# EAGLE design stm32103c8t6-v5 (EAGLE 7.4.0)
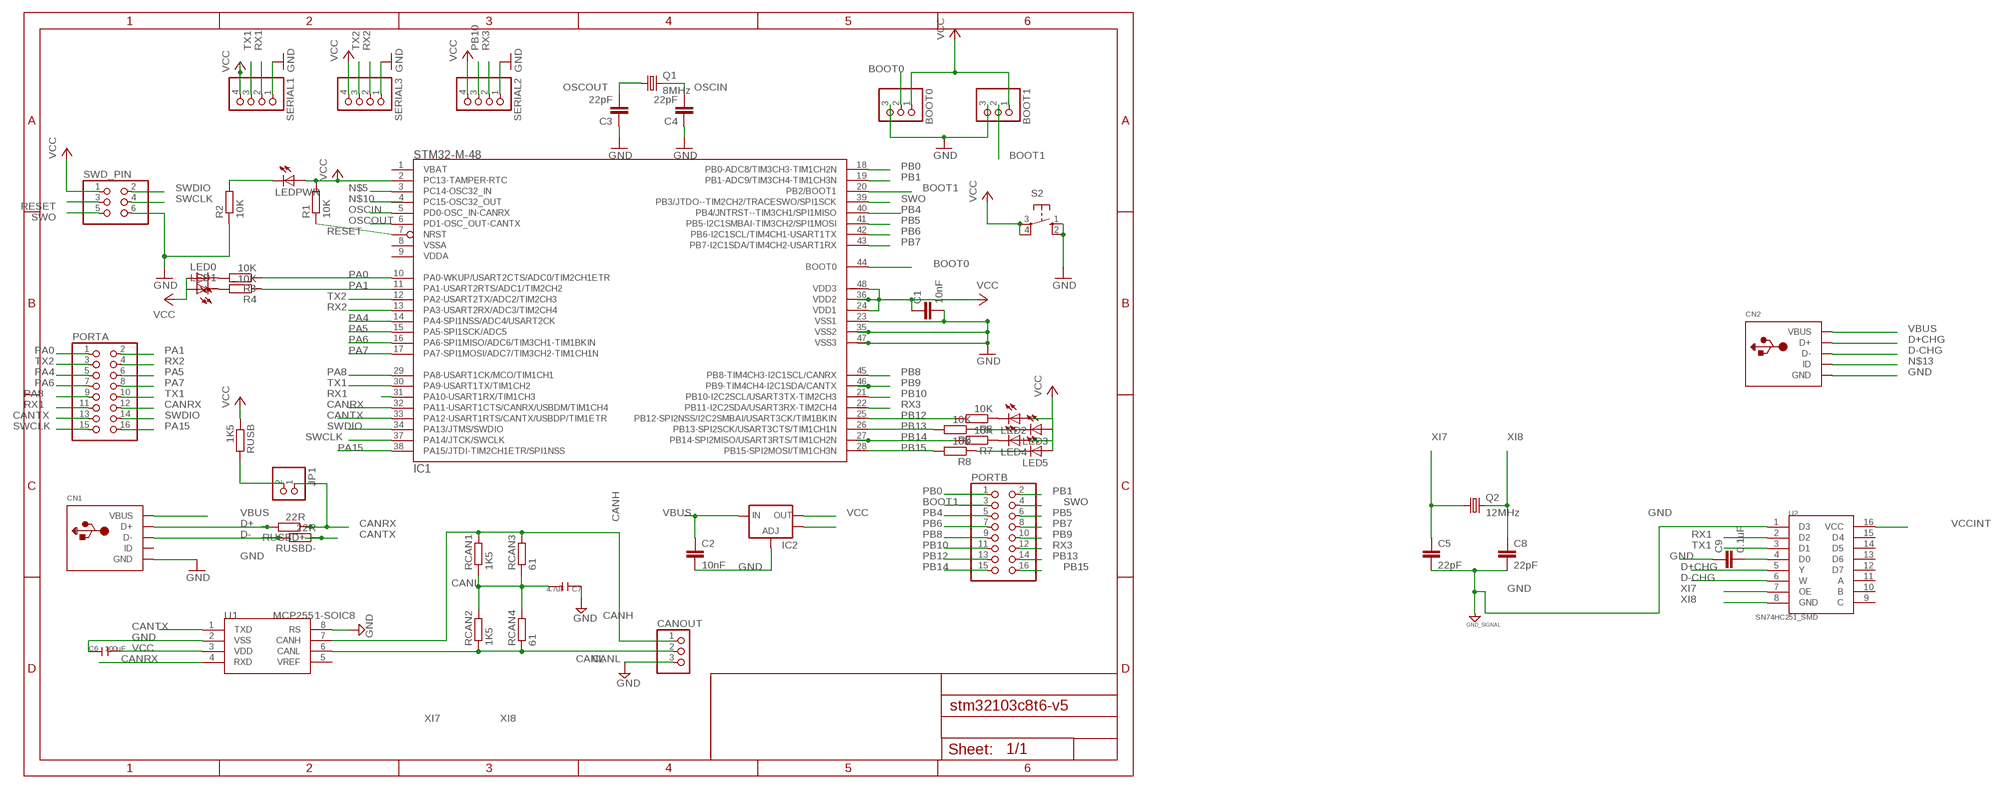
[diagram p0: schematic, sheet 1]

## Parts
BOOT0  PINHD-1X3  [1X03]
BOOT1  PINHD-1X3  [1X03]
C1  10nF  C-EUC1210  [C1210]
C2  10nF  C-EUC1206  [C1206]
C3  22pF  C-EUC1210  [C1210]
C4  22pF  C-EUC1210  [C1210]
C5  22pF  C-EUC1206  [C1206]
C6  100uF  C-1206  [C1206]
C7  4.7uF  C-1206  [C1206]
C8  22pF  C-EUC1206  [C1206]
C9  0.1uF  C-EUC1206  [C1206]
CANOUT  PINHD-1X3  [1X03]
CN1  USBTHM  [USB-MINIB-THM]
CN2  USBTHM  [USB-MINIB-THM]
IC1  STM32-M-48  [LQFP48]
IC2  V_REG_LM1117SOT223  [SOT223]
JP1  PINHD-1X2  [1X02]
LED0  LEDSMT1206  [1206]
LED1  LEDSMT1206  [1206]
LED2  LEDSMT1206  [1206]
LED3  LEDSMT1206  [1206]
LED4  LEDSMT1206  [1206]
LED5  LEDSMT1206  [1206]
LEDPWR  LEDSMT1206  [1206]
PORTA  PINHD-2X8  [2X08]
PORTB  PINHD-2X8  [2X08]
Q1  8MHz  CRYSTALHC49S  [HC49/S]
Q2  12MHz  CRYSTALHC49S  [HC49/S]
R1  10K  R-EU_R1206  [R1206]
R2  10K  R-EU_R1206  [R1206]
R3  10K  R-EU_R1206  [R1206]
R4  10K  R-EU_R1206  [R1206]
R5  10K  R-EU_R1206  [R1206]
R6  10K  R-EU_R1206  [R1206]
R7  10K  R-EU_R1206  [R1206]
R8  10K  R-EU_R1206  [R1206]
RCAN1  1K5  R-EU_R1206  [R1206]
RCAN2  1K5  R-EU_R1206  [R1206]
RCAN3  61  R-EU_R1206  [R1206]
RCAN4  61  R-EU_R1206  [R1206]
RUSB  1K5  R-EU_R1206  [R1206]
RUSBD+  22R  R-EU_R1206  [R1206]
RUSBD-  22R  R-EU_R1206  [R1206]
S2  10-XX  [B3F-10XX]
SERIAL1  PINHD-1X4  [1X04]
SERIAL2  PINHD-1X4  [1X04]
SERIAL3  PINHD-1X4  [1X04]
SWD_PIN  PINHD-2X3  [2X03]
U1  MCP2551-SOIC8  [SOIC8-6.0]
U2  SN74HC251_SMD  [SO016]

## Nets
BOOT0: BOOT0.2 IC1.44(BOOT0)
BOOT1: BOOT1.2 IC1.20(PB2/BOOT1) PORTB.3
CANH [CAN]: CANOUT.1 RCAN1.2 RCAN3.2 U1.7(CANH)
CANL [CAN]: CANOUT.2 RCAN2.1 RCAN4.1 U1.6(CANL)
CANRX: IC1.32(PA11-USART1CTS/CANRX/USBDM/TIM1CH4) JP1.1 PORTA.12 RUSBD+.1 U1.4(RXD)
CANTX: IC1.33(PA12-USART1RTS/CANTX/USBDP/TIM1ETR) PORTA.13 RUSBD-.1 U1.1(TXD)
D+: CN1.D+ RUSBD+.2
D+CHG: CN2.D+ U2.5(Y)
D-: CN1.D- RUSBD-.2
D-CHG: CN2.D- U2.6(W)
GND [GND]: BOOT0.3 BOOT1.3 C1.2 C2.2 C3.1 C4.1 C5.2 C6.1 C7.1 C8.2 C9.1 CANOUT.3 CN1.GND CN2.GND IC1.23(VSS1) IC1.35(VSS2) IC1.47(VSS3) IC2.1(ADJ) R2.1 S2.1(S) S2.2(S1) SERIAL1.1 SERIAL2.1 SERIAL3.1 SWD_PIN.6 U1.2(VSS) U1.8(RS) U2.1(D3) ; supply symbol labelled GND_SIGNAL
N$1: IC2.4(OUT)
N$2: LED0.C R3.2
N$3: LED1.C R4.2
N$4: LEDPWR.C R2.2
N$5: IC1.3(PC14-OSC32_IN)
N$6: LED2.C R5.1
N$7: LED3.C R6.1
N$8: LED4.C R7.1
N$9: LED5.C R8.1
N$11: C9.2 U2.4(D0)
N$12: JP1.2 RUSB.2
N$13: CN2.ID
OSCIN: C4.2 IC1.5(PD0-OSC_IN-CANRX) Q1.2
OSCOUT: C3.2 IC1.6(PD1-OSC_OUT-CANTX) Q1.1
PA0: IC1.10(PA0-WKUP/USART2CTS/ADC0/TIM2CH1ETR) PORTA.1 R3.1
PA1: IC1.11(PA1-USART2RTS/ADC1/TIM2CH2) PORTA.2 R4.1
PA4: IC1.14(PA4-SPI1NSS/ADC4/USART2CK) PORTA.5
PA5: IC1.15(PA5-SPI1SCK/ADC5) PORTA.6
PA6: IC1.16(PA6-SPI1MISO/ADC6/TIM3CH1-TIM1BKIN) PORTA.7
PA7: IC1.17(PA7-SPI1MOSI/ADC7/TIM3CH2-TIM1CH1N) PORTA.8
PA8: IC1.29(PA8-USART1CK/MCO/TIM1CH1) PORTA.9
PA15: IC1.38(PA15/JTDI-TIM2CH1ETR/SPI1NSS) PORTA.16
PB0: IC1.18(PB0-ADC8/TIM3CH3-TIM1CH2N) PORTB.1
PB1: IC1.19(PB1-ADC9/TIM3CH4-TIM1CH3N) PORTB.2
PB4: IC1.40(PB4/JNTRST--TIM3CH1/SPI1MISO) PORTB.5
PB5: IC1.41(PB5-I2C1SMBAI-TIM3CH2/SPI1MOSI) PORTB.6
PB6: IC1.42(PB6-I2C1SCL/TIM4CH1-USART1TX) PORTB.7
PB7: IC1.43(PB7-I2C1SDA/TIM4CH2-USART1RX) PORTB.8
PB8: IC1.45(PB8-TIM4CH3-I2C1SCL/CANRX) PORTB.9
PB9: IC1.46(PB9-TIM4CH4-I2C1SDA/CANTX) PORTB.10
PB10: IC1.21(PB10-I2C2SCL/USART3TX-TIM2CH3) PORTB.11 SERIAL2.3
PB12: IC1.25(PB12-SPI2NSS/I2C2SMBAI/USART3CK/TIM1BKIN) PORTB.13 R5.2
PB13: IC1.26(PB13-SPI2SCK/USART3CTS/TIM1CH1N) PORTB.14 R6.2
PB14: IC1.27(PB14-SPI2MISO/USART3RTS/TIM1CH2N) PORTB.15 R7.2
PB15: IC1.28(PB15-SPI2MOSI/TIM1CH3N) PORTB.16 R8.2
RESET: IC1.7(NRST) R1.1 SWD_PIN.3
RX1: IC1.31(PA10-USART1RX/TIM1CH3) PORTA.11 SERIAL1.2 U2.2(D2)
RX2: IC1.13(PA3-USART2RX/ADC3/TIM2CH4) PORTA.4 SERIAL3.2
RX3: IC1.22(PB11-I2C2SDA/USART3RX-TIM2CH4) PORTB.12 SERIAL2.2
SWCLK: IC1.37(PA14/JTCK/SWCLK) PORTA.15 SWD_PIN.4
SWDIO: IC1.34(PA13/JTMS/SWDIO) PORTA.14 SWD_PIN.2
SWO: IC1.39(PB3/JTDO--TIM2CH2/TRACESWO/SPI1SCK) PORTB.4 SWD_PIN.5
TX1: IC1.30(PA9-USART1TX/TIM1CH2) PORTA.10 SERIAL1.3 U2.3(D1)
TX2: IC1.12(PA2-USART2TX/ADC2/TIM2CH3) PORTA.3 SERIAL3.3
UNIC: C7.2 RCAN1.1 RCAN2.2 RCAN3.1 RCAN4.2
VBUS: C2.1 CN1.VBUS CN2.VBUS IC2.3(IN)
VCC [POWER]: BOOT0.1 BOOT1.1 C1.1 C6.2 IC1.2(PC13-TAMPER-RTC) IC1.24(VDD1) IC1.36(VDD2) IC1.48(VDD3) IC2.2(OUT) LED0.A LED1.A LED2.A LED3.A LED4.A LED5.A LEDPWR.A R1.2 RUSB.1 S2.3(P) S2.4(P1) SERIAL1.4 SERIAL2.4 SERIAL3.4 SWD_PIN.1 U1.3(VDD)
VCCINT [POWER]: U2.16(VCC)
XI7: C5.1 Q2.1 U2.7(OE)
XI8: C8.1 Q2.2 U2.8(GND)
Unconnected: CN1.ID IC1.1(VBAT) IC1.4(PC15-OSC32_OUT) IC1.8(VSSA) IC1.9(VDDA) U1.5(VREF) U2.9(C) U2.10(B) U2.11(A) U2.12(D7) U2.13(D6) U2.14(D5) U2.15(D4)

## Library data of the parts
BOOT0 BOOT1 CANOUT = pinhead:PINHD-1X3: PIN HEADER
C1-C5 C8 C9 = rcl:C-EU: CAPACITOR, European symbol
C6 C7 = Discrete:C*: Ceramic Capacitors
CN1 CN2 = adafruit:USB: USB Connectors USBMINIB - Surface Mount Female Mini-B USB Connector 4UConnector: 06564 By microbuilder.eu Thru-hole RA Female Mini-B USB Connector 4UConnector: 18732 By ladyada.net
IC1 = pel_stm32:STM32-M-48: STM32F103 Medium Density 48pins
IC2 = SparkFun-PowerIC:V_REG_LM1117: Voltage Regulator LM1117 Standard adjustable voltage regulator but in SMD form. Spark Fun Electronics SKU : COM-00595
JP1 = pinhead:PINHD-1X2: PIN HEADER
LED0 LED1-LED5 LEDPWR = led:LED: LED OSRAM: - CHIPLED LG R971, LG N971, LY N971, LG Q971, LY Q971, LO R971, LY R971 LH N974, LH R974 LS Q976, LO Q976, LY Q976 LO Q996 - Hyper CHIPLED LW Q18S LB Q993, LB Q99A, LB R99A - SideLED LS A670, LO A670, LY A670, LG A670, LP A670 LB A673, LV A673, LT A673, LW A673 LH A674 LY A675 LS A676, LA A676, LO A676, LY A676, LW A676 LS A679, LY A679, LG A679 - Hyper Micro SIDELED® LS Y876, LA Y876, LO Y876, LY Y876 LT Y87S - SmartLED LW L88C, LW L88S LB L89C, LB L89S, LG L890 LS L89K, LO L89K, LY L89K LS L896, LA L896, LO L896, LY L896 - TOPLED LS T670, LO T670, LY T670, LG T670, LP T670 LSG T670, LSP T670, LSY T670, LOP T670, LYG T670 LG T671, LOG T671, LSG T671 LB T673, LV T673, LT T673, LW T673 LH T674 LS T676, LA T676, LO T676, LY T676, LB T676, LH T676, LSB T676, LW T676 LB T67C, LV T67C, LT T67C, LS T67K, LO T67K, LY T67K, LW E67C LS E67B, LA E67B, LO E67B, LY E67B, LB E67C, LV E67C, LT E67C LW T67C LS T679, LY T679, LG T679 LS T770, LO T770, LY T770, LG T770, LP T770 LB T773, LV T773, LT T773, LW T773 LH T774 LS E675, LA E675, LY E675, LS T675 LS T776, LA T776, LO T776, LY T776, LB T776 LHGB T686 LT T68C, LB T68C - Hyper Mini TOPLED® LB M676 - Mini TOPLED Santana® LG M470 LS M47K, LO M47K, LY M47K Source: http://www.osram.convergy.de LUXEON: - LUMILED® LXK2-PW12-R00, LXK2-PW12-S00, LXK2-PW14-U00, LXK2-PW14-V00 LXK2-PM12-R00, LXK2-PM12-S00, LXK2-PM14-U00 LXK2-PE12-Q00, LXK2-PE12-R00, LXK2-PE12-S00, LXK2-PE14-T00, LXK2-PE14-U00 LXK2-PB12-K00, LXK2-PB12-L00, LXK2-PB12-M00, LXK2-PB14-N00, LXK2-PB14-P00, LXK2-PB14-Q00 LXK2-PR12-L00, LXK2-PR12-M00, LXK2-PR14-Q00, LXK2-PR14-R00 LXK2-PD12-Q00, LXK2-PD12-R00, LXK2-PD12-S00 LXK2-PH12-R00, LXK2-PH12-S00 LXK2-PL12-P00, LXK2-PL12-Q00, LXK2-PL12-R00 Source: www.luxeon.com KINGBRIGHT: KA-3528ASYC Source: www.kingbright.com
PORTA PORTB = pinhead:PINHD-2X8: PIN HEADER
Q1 Q2 = crystal:CRYSTAL: CRYSTAL; OC_FARNELL: 1667008; OC_NEWARK: unknown
R1-R8 RCAN1-RCAN4 RUSB RUSBD+ RUSBD- = resistor:R-EU_: RESISTOR, European symbol
S2 = switch-omron:10-XX: OMRON SWITCH; MPN: B3F-1000; OC_FARNELL: 176432; OC_NEWARK: 36M3542
SERIAL1-SERIAL3 = pinhead:PINHD-1X4: PIN HEADER
SWD_PIN = pinhead:PINHD-2X3: PIN HEADER
U1 = IC:MCP2551: High-Speed CAN Transceiver http://ww1.microchip.com/downloads/en/devicedoc/21667f.pdf
U2 = SparkFun-DigitalIC:SN74HC251: SN54HC251 Data Selector/Multiplexer

## Net classes
3 CAN: width 0.356 mm

## Board
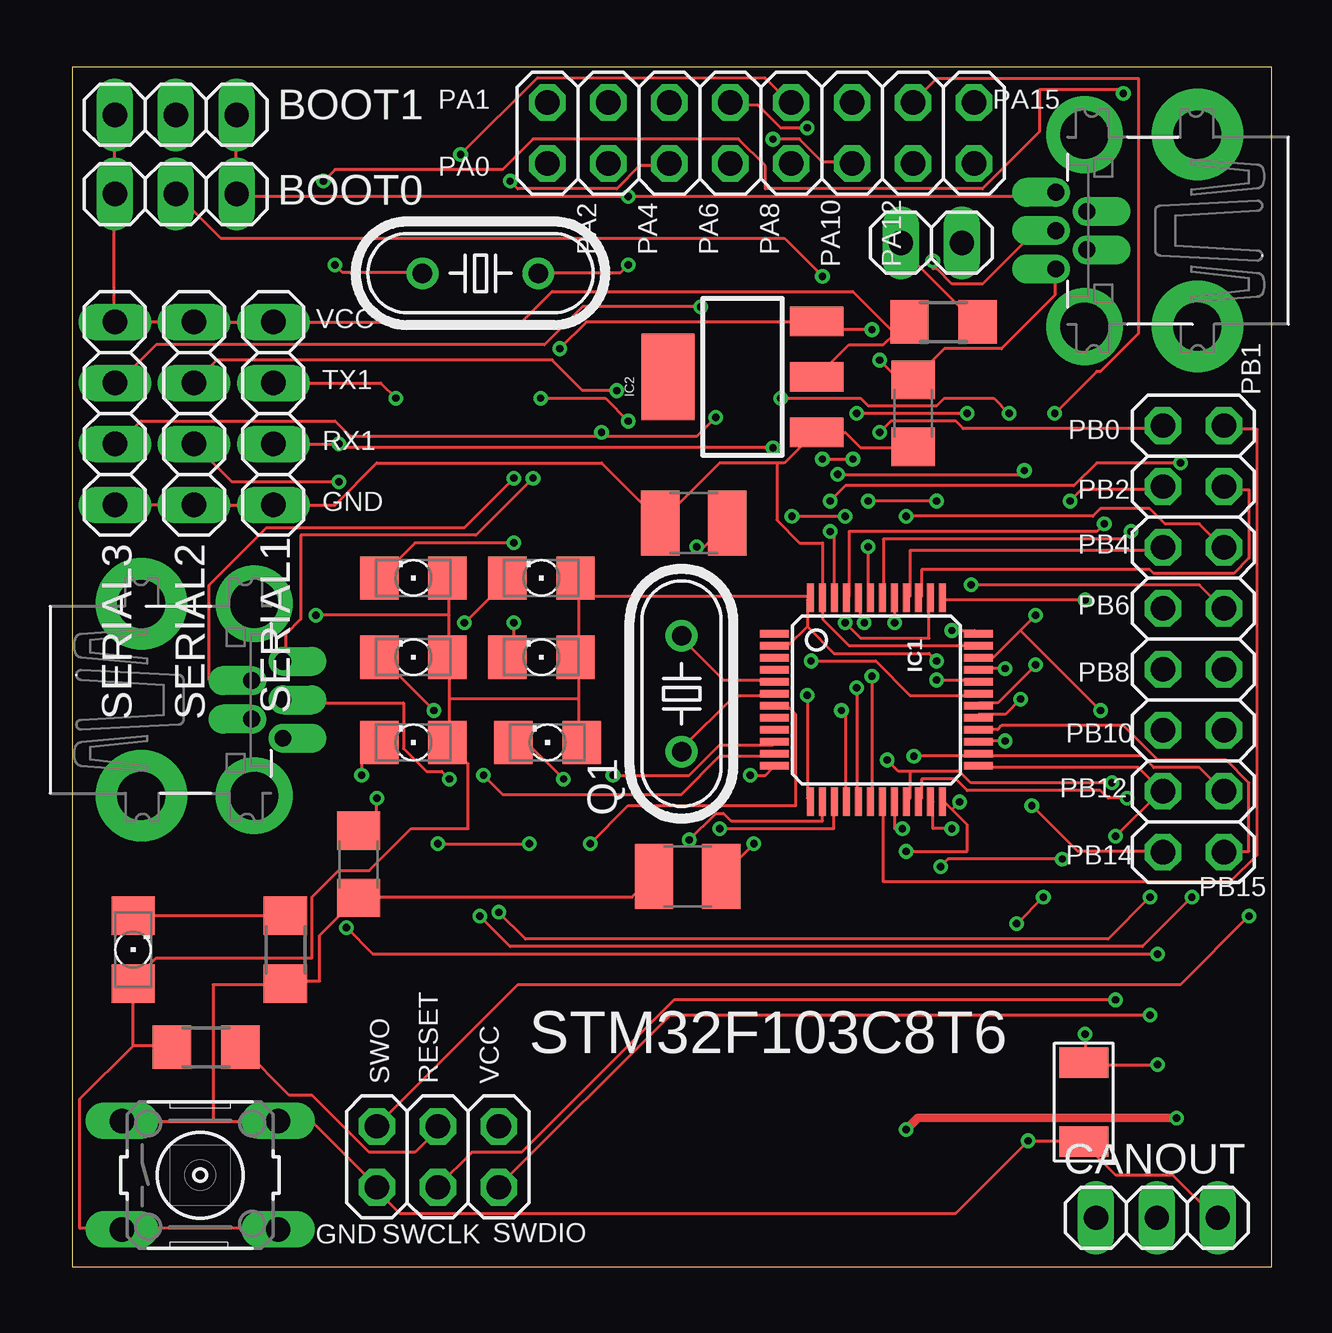
[diagram p1: board, top side]
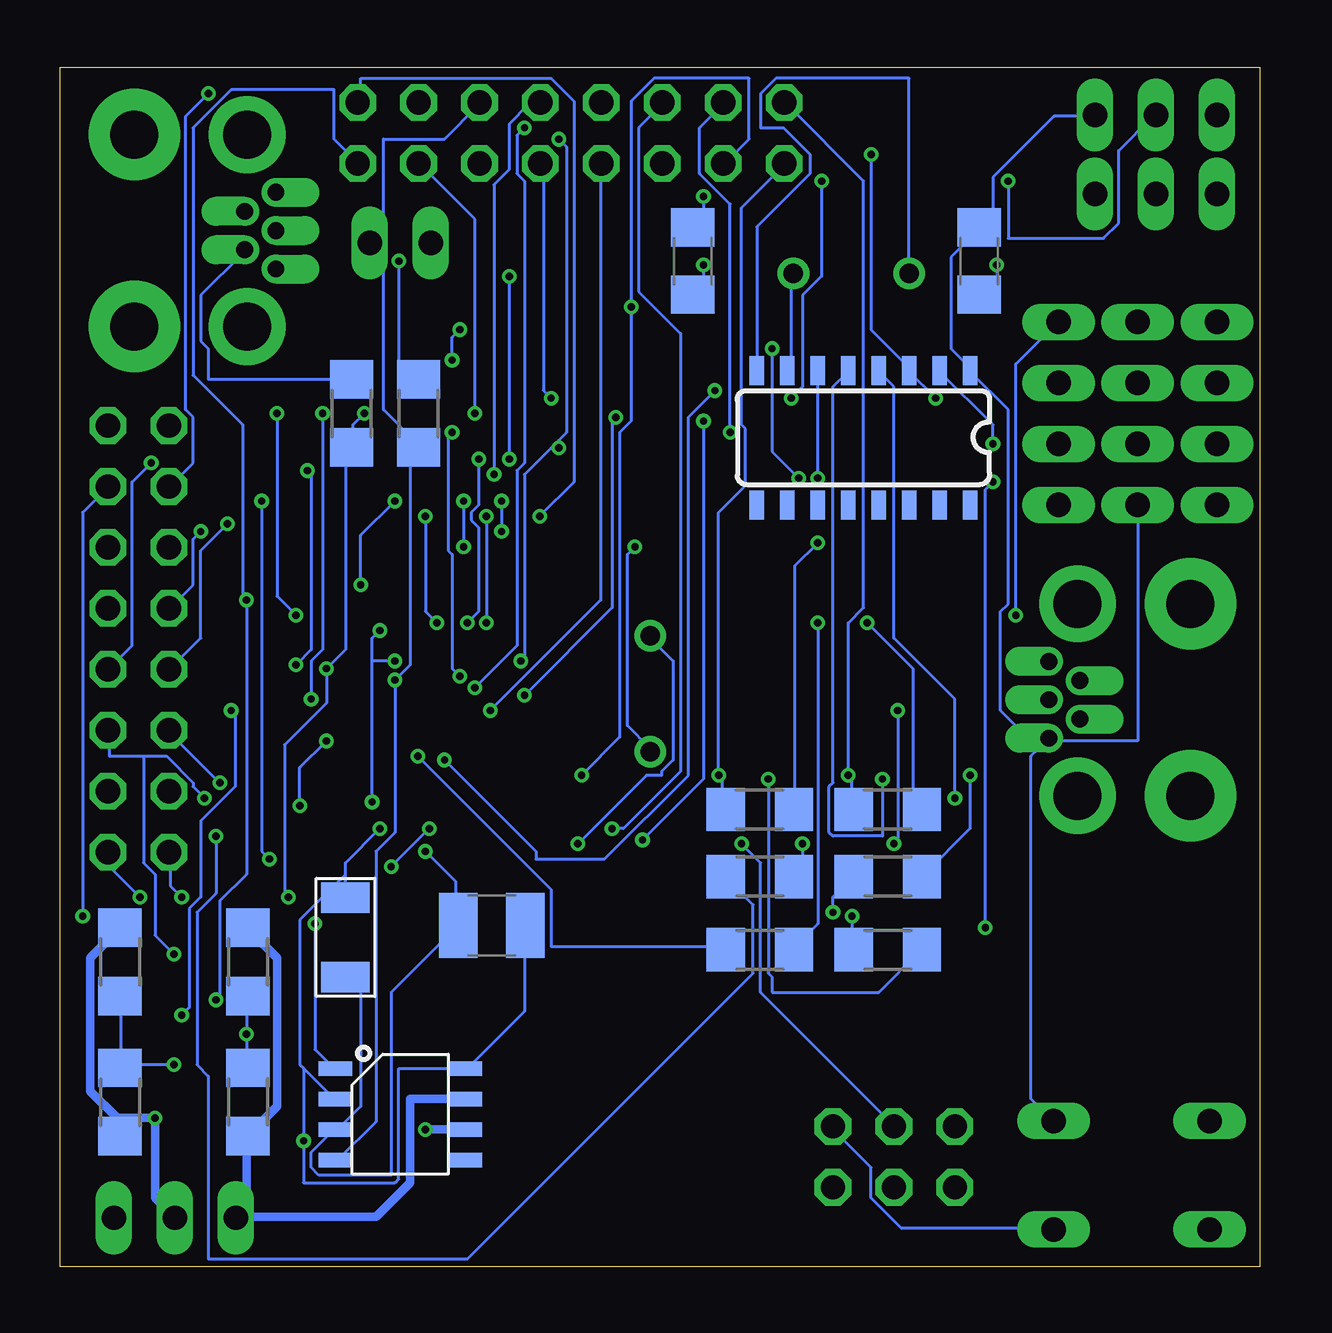
[diagram p2: board, bottom side, seen from below]

Size 50 x 50 mm. Coordinates in mm from the lower left corner, seen from the top.
Outline: 0,0 50,0 50,50 0,50 0,0
Copper layers (1*16): Top 0.035mm / dielectric 1.5mm / Bottom 0.035mm
Design rules "dirt_cheap_dirty_boards.v1": minimum track width 5mil, minimum drill 12mil, track to track 5mil, track to pad 5mil, pad to pad 5mil, via to via 5mil, smd to smd 0mil, copper to edge 10mil, drill to drill 10mil, minimum pad ring 10mil, minimum via ring 6mil, stop-mask expansion 2mil, vias tented up to drill 25mil, thermal gap 10mil

### Footprints (pad centres in the part's own frame; a part is rotated, then mirrored left to right if it is on the bottom)
1X03 = drill 1.016 long: 1 -2.54,0; 2 0,0; 3 2.54,0
C1210 = smd 1.6 x 2.7: 1 -1.4,0; 2 1.4,0
C1206 = smd 1.6 x 1.8: 1 -1.4,0; 2 1.4,0
C1206' = smd 1.27 x 2.032: 1 -1.651,0; 2 1.651,0
USB-MINIB-THM = drill 0.7 offset: D+ 0,9.8; D- -0.8,8.5; GND 1.6,9.8; ID 0.8,8.5; VBUS -1.6,9.8 | drill 2 pad 3.81: GND1 -4,3.9; GND4 4,3.9 | drill 2 pad 3.2: GND2 -4,8.6; GND3 4,8.6
LQFP48 = smd 0.3 x 1.2: 1 -2.75,-4.25; 2 -2.25,-4.25; 3 -1.75,-4.25; 4 -1.25,-4.25; 5 -0.75,-4.25; 6 -0.25,-4.25; 7 0.25,-4.25; 8 0.75,-4.25; 9 1.25,-4.25; 10 1.75,-4.25; 11 2.25,-4.25; 12 2.75,-4.25; 25 2.75,4.25; 26 2.25,4.25; 27 1.75,4.25; 28 1.25,4.25; 29 0.75,4.25; 30 0.25,4.25; 31 -0.25,4.25; 32 -0.75,4.25; 33 -1.25,4.25; 34 -1.75,4.25; 35 -2.25,4.25; 36 -2.75,4.25 | smd 1.2 x 0.3: 13 4.25,-2.75; 14 4.25,-2.25; 15 4.25,-1.75; 16 4.25,-1.25; 17 4.25,-0.75; 18 4.25,-0.25; 19 4.25,0.25; 20 4.25,0.75; 21 4.25,1.25; 22 4.25,1.75; 23 4.25,2.25; 24 4.25,2.75; 37 -4.25,2.75; 38 -4.25,2.25; 39 -4.25,1.75; 40 -4.25,1.25; 41 -4.25,0.75; 42 -4.25,0.25; 43 -4.25,-0.25; 44 -4.25,-0.75; 45 -4.25,-1.25; 46 -4.25,-1.75; 47 -4.25,-2.25; 48 -4.25,-2.75
SOT223 = smd 1.219 x 2.235: 1 -2.311,-3.099; 2 0,-3.099; 3 2.311,-3.099 | smd 3.6 x 2.2: 4 0,3.099
1X02 = drill 1.016 long: 1 -1.27,0; 2 1.27,0
1206 = smd 1.6 x 1.803: A -1.422,0; C 1.422,0
2X08 = drill 1.016 octagon: 1 -8.89,-1.27; 2 -8.89,1.27; 3 -6.35,-1.27; 4 -6.35,1.27; 5 -3.81,-1.27; 6 -3.81,1.27; 7 -1.27,-1.27; 8 -1.27,1.27; 9 1.27,-1.27; 10 1.27,1.27; 11 3.81,-1.27; 12 3.81,1.27; 13 6.35,-1.27; 14 6.35,1.27; 15 8.89,-1.27; 16 8.89,1.27
HC49/S = drill 0.813: 1 -2.413,0; 2 2.413,0
R1206 = smd 1.6 x 1.803: 1 -1.422,0; 2 1.422,0
B3F-10XX = drill 1.016 long: 1 -3.251,2.261; 2 3.251,2.261; 3 -3.251,-2.261; 4 3.251,-2.261
1X04 = drill 1.016 long: 1 -3.81,0; 2 -1.27,0; 3 1.27,0; 4 3.81,0
2X03 = drill 1.016 octagon: 1 -2.54,-1.27; 2 -2.54,1.27; 3 0,-1.27; 4 0,1.27; 5 2.54,-1.27; 6 2.54,1.27
SOIC8-6.0 = smd 0.6 x 1.4: 1 -1.905,-2.7; 2 -0.635,-2.7; 3 0.635,-2.7; 4 1.905,-2.7; 5 1.905,2.7; 6 0.635,2.7; 7 -0.635,2.7; 8 -1.905,2.7
SO016 = smd 0.6 x 1.2: 1 -4.445,-2.8; 2 -3.175,-2.8; 3 -1.905,-2.8; 4 -0.635,-2.8; 5 0.635,-2.8; 6 1.905,-2.8; 7 3.175,-2.8; 8 4.445,-2.8; 9 4.445,2.8; 10 3.175,2.8; 11 1.905,2.8; 12 0.635,2.8; 13 -0.635,2.8; 14 -1.905,2.8; 15 -3.175,2.8; 16 -4.445,2.8

### Placement (x,y rotation side)
BOOT0  4.32,44.7 0 top
BOOT1  4.32,48.01 0 top
C1  32,14.22 0 bottom
C2  35.05,35.56 270 top
C3  25.91,30.99 0 top
C4  25.65,16.26 0 top
C5  23.62,41.91 90 bottom
C6  100uF  [C1206']  38.1,13.72 270 bottom
C7  4.7uF  [C1206']  42.16,6.86 90 top
C8  11.68,41.91 90 bottom
C9  11.94,16.76 90 top
CANOUT  45.21,2.03 0 top
CN1  50.8,43.18 90 top
CN2  -1.02,23.62 270 top
IC1  33.53,23.62 270 top
IC2  27.94,37.08 90 top
JP1  35.81,42.67 180 top
LED0  14.22,28.7 180 top
LED1  19.56,28.7 180 top
LED2  14.22,25.4 180 top
LED3  19.56,25.4 180 top
LED4  14.22,21.84 180 top
LED5  19.81,21.84 180 top
LEDPWR  2.54,13.21 90 top
PORTA  28.7,47.24 0 top
PORTB  46.74,26.16 270 top
Q1  25.4,23.88 90 top
Q2  17.02,41.4 180 top
R1  5.59,9.14 180 top
R2  8.89,13.21 90 top
R3  20.83,19.05 0 bottom
R4  15.49,19.05 0 bottom
R5  20.83,16.26 180 bottom
R6  20.83,13.21 180 bottom
R7  15.49,16.26 180 bottom
R8  15.49,13.21 180 bottom
RCAN1  42.16,12.7 90 bottom
RCAN2  47.5,12.7 270 bottom
RCAN3  42.16,6.86 270 bottom
RCAN4  47.5,6.86 90 bottom
RUSB  36.32,39.37 0 top
RUSBD+  35.05,35.56 90 bottom
RUSBD-  37.85,35.56 90 bottom
S2  5.33,3.81 0 top
SERIAL1  8.38,35.56 90 top
SERIAL2  5.08,35.56 90 top
SERIAL3  1.78,35.56 90 top
SWD_PIN  15.24,4.57 180 top
U1  35.81,6.35 270 bottom
U2  16.51,34.54 180 bottom

### Tracks (layer width: path | path; a pad name or v marks a point on that pad's centre or on a via)
BOOT0  (via drill 0.3)
  Top 0.127: v33.02,26.83 32.86,26.83 32.86,27.78 IC1.44 | v31.27,33.66 v32.54,33.66 | v31.27,41.27 29.69,42.86 6.19,42.86 4.45,44.61 BOOT0.2
  Bottom 0.127: v33.02,26.83 32.54,27.3 32.54,30.8 32.86,31.11 32.86,31.43 32.54,31.75 v32.54,33.66 | v31.27,41.27 v31.27,33.66
BOOT1  (via drill 0.3)
  Top 0.127: v34.61,18.26 34.29,18.26 IC1.20 | v36.2,16.67 36.51,16.99 v41.27,16.99 | v41.59,31.91 42.07,32.38 45.4,32.38 PORTB.3 | v10.48,45.24 10.95,45.72 17.94,45.72 19.21,46.99 27.78,46.99 28.89,45.88 28.89,44.93 37.94,44.93 40.32,47.31 40.32,49.05 43.66,49.05 v43.81,48.9
  Bottom 0.127: v36.2,16.67 v34.61,18.26 | v41.27,16.99 41.59,17.3 v41.59,31.91 | v10.48,45.24 10.48,42.86 6.51,42.86 5.87,43.5 5.87,46.51 4.45,47.94 BOOT1.2 | v43.81,48.9 44.77,47.94 44.77,35.72 44.45,35.4 44.45,33.5 45.4,32.54 PORTB.3
CANH
  Bottom 0.356: U1.7 35.4,6.99 35.4,3.49 36.83,2.06 42.55,2.06 CANOUT.1 42.23,2.22 42.23,5.4 RCAN3.2 42.07,5.56 40.96,6.67 40.96,12.86 42.07,13.97 RCAN1.2
CANL  (via drill 0.3)
  Top 0.356: v34.77,5.71 35.24,6.19 v46.04,6.19
  Bottom 0.356: v34.77,5.71 U1.6 | RCAN2.1 47.62,13.97 48.74,12.86 48.74,7.3 47.62,6.19 RCAN4.1 47.47,5.56 47.47,6.19 v46.04,6.19 46.04,2.86 CANOUT.2
CANRX  (via drill 0.3)
  Top 0.127: v36.04,24.45 37.62,24.45 IC1.32
  Bottom 0.127: PORTA.12 32.54,48.42 33.97,46.99 36.51,46.99 36.51,43.18 36.99,42.7 JP1.1 36.99,42.55 36.51,42.07 36.51,35.72 35.08,34.29 RUSBD+.1 35.08,34.13 35.4,33.81 35.4,25.08 v36.04,24.45 36.04,18.1 36.83,17.3 36.83,6.03 38.42,4.45 U1.4
CANTX  (via drill 0.3)
  Top 0.127: v38.89,24.92 37.78,24.92 IC1.33 | v40.48,15.4 v39.37,14.29 | v37.31,35.56 v32.7,35.56
  Bottom 0.127: v39.37,14.29 39.37,9.05 38.58,8.26 U1.1 | v40.48,15.4 40.64,15.56 40.64,21.75 38.89,23.5 v38.89,24.92 38.1,25.72 38.1,33.97 37.94,34.13 RUSBD-.1 37.78,34.29 37.78,35.08 v37.31,35.56 | v32.7,35.56 32.7,43.66 34.92,45.88 PORTA.13
D+  (via drill 0.3)
  Top 0.127: v35.88,41.91 35.88,41.59 36.04,41.59 36.67,40.96 37.94,40.96 40.16,43.18 CN1.D+
  Bottom 0.127: v35.88,41.91 35.88,37.78 35.08,36.99 RUSBD+.2
D+CHG  (via drill 0.3)
  Top 0.127: v15.72,20.32 15.4,20.64 14.76,20.64 13.81,21.59 13.81,23.5 8.89,23.5 CN2.D+
  Bottom 0.127: v15.72,20.32 15.72,17.94 17.78,17.94 17.94,18.1 17.94,20 17.78,20.16 17.78,36.67 17.14,37.31 U2.5
D-
  Bottom 0.127: RUSBD-.2 37.94,36.99 43.81,36.99 43.81,38.26 44.13,38.58 44.13,40.48 42.39,42.23 CN1.D-
D-CHG  (via drill 0.3)
  Top 0.127: v18.41,32.86 16.35,30.8 8.1,30.8 5.71,28.42 5.71,24.45 7.46,24.45 CN2.D-
  Bottom 0.127: v18.41,32.86 U2.6
GND  (via drill 0.3)
  Top 0.127: CN1.GND 40.96,44.77 40.8,44.61 v23.18,44.61 6.99,44.61 BOOT0.3 6.83,44.77 6.83,47.94 BOOT1.3 | CANOUT.3 47.62,2.06 45.88,3.81 43.5,3.81 42.23,5.08 C7.1 42.07,5.24 v39.85,5.24 36.83,2.22 13.65,2.22 12.7,3.17 SWD_PIN.6 12.7,3.33 10,6.03 8.73,6.03 S2.2 8.57,6.03 5.87,6.03 | v36.67,18.26 35.88,18.26 35.88,19.37 IC1.23 | IC1.35 37.62,25.88 32.38,25.88 31.27,26.99 31.27,27.78 IC1.47 31.27,27.94 31.27,30.16 30.32,30.16 29.37,31.11 29.37,33.5 | C2.2 34.92,34.13 32.86,34.13 32.23,34.77 31.11,34.77 IC2.1 30.96,34.77 29.69,33.5 29.37,33.5 | 29.37,33.5 26.99,33.5 24.61,31.11 C3.1 24.45,31.11 22.07,33.5 12.7,33.5 10.95,31.75 SERIAL1.1 SERIAL2.1 SERIAL3.1 | 5.87,6.03 2.22,6.03 S2.1 | C4.1 24.13,16.19 23.34,15.4 12.06,15.4 C9.1 11.91,15.24 11.43,14.76 11.27,14.76 10.32,13.81 10.32,11.91 8.89,11.91 R2.1 8.89,11.75 5.87,11.75 5.87,6.03
  Bottom 0.127: v23.18,44.61 23.18,43.66 23.5,43.34 C5.2 | BOOT1.3 6.99,47.94 8.57,47.94 11.11,45.4 11.11,43.81 11.59,43.34 C8.2 11.75,43.18 12.86,42.07 12.86,38.26 12.06,37.47 U2.1 12.06,37.31 10.48,35.72 10.48,27.62 10.79,27.3 10.79,23.18 9.21,21.59 | C1.2 30.64,14.13 30.64,10.64 33.02,8.26 U1.8 35.88,8.26 35.88,3.65 36.04,3.49 39.85,3.49 v39.85,5.24 39.85,8.26 | v36.67,18.26 38.1,16.83 38.1,16.35 | C6.1 38.1,16.35 | 39.85,8.26 40.01,8.41 40.01,14.45 38.1,16.35 | 39.85,8.26 38.58,6.99 U1.2 | SERIAL2.1 5.08,21.91 8.73,21.91 CN2.GND | 9.21,21.59 9.53,21.27 9.53,6.99 8.73,6.19 S2.2 | 9.21,21.59 8.89,21.91 CN2.GND | 9.21,21.59 CN2.GND
N$2  (via drill 0.3)
  Top 0.127: v18.41,30.16 14.29,30.16 12.86,28.73 LED0.C
  Bottom 0.127: v18.41,30.16 19.37,29.21 19.37,19.05 R3.2
N$3  (via drill 0.3)
  Top 0.127: v16.35,26.83 18.1,28.57 LED1.C
  Bottom 0.127: v16.35,26.83 14.45,24.92 14.45,19.37 14.13,19.05 R4.2
N$4
  Top 0.127: LEDPWR.C 2.54,14.61 8.89,14.61 R2.2
N$6  (via drill 0.3)
  Top 0.127: v15.24,17.62 v19.05,17.62 | v15.08,23.18 12.86,25.4 LED2.C
  Bottom 0.127: v19.05,17.62 19.05,16.67 19.37,16.35 R5.1 | v15.24,17.62 15.08,17.78 v15.08,23.18
N$7  (via drill 0.3)
  Top 0.127: v18.41,26.83 18.41,25.4 LED3.C
  Bottom 0.127: v18.41,26.83 18.41,14.29 19.37,13.34 R6.1
N$8  (via drill 0.3)
  Top 0.127: v12.06,20.48 12.06,21.75 12.7,21.75 LED4.C
  Bottom 0.127: v12.06,20.48 12.06,18.26 13.97,16.35 R7.1
N$9  (via drill 0.3)
  Top 0.127: v20.48,20.32 19.05,21.75 18.41,21.75 LED5.C
  Bottom 0.127: v20.48,20.32 20.48,12.22 20.32,12.06 20.32,11.43 15.88,11.43 14.13,13.18 R8.1
N$11  (via drill 0.3)
  Top 0.127: v12.7,19.53 12.7,18.26 12.06,18.26 C9.2
  Bottom 0.127: v12.7,19.53 12.7,23.65 15.24,26.19 15.24,36.67 15.88,37.31 U2.4
N$12
  Top 0.127: RUSB.2 37.62,39.37 34.45,42.55 JP1.2
OSCIN  (via drill 0.3)
  Top 0.127: IC1.5 29.21,24.45 27.15,24.45 25.4,26.19 Q1.2 | v28.42,17.62 27.15,16.35 C4.2
  Bottom 0.127: v28.42,17.62 25.56,20.48 24.92,20.48 24.92,20.64 24.45,21.11 24.45,25.24 25.4,26.19 Q1.2
OSCOUT  (via drill 0.3)
  Top 0.127: IC1.6 29.21,23.81 27.62,23.81 25.4,21.59 Q1.1 | v26.04,30 26.35,30 27.3,30.96 C3.2
  Bottom 0.127: v26.04,30 26.35,29.69 26.35,22.54 25.4,21.59 Q1.1
PA0  (via drill 0.3)
  Top 0.127: v22.54,20.48 25.72,20.48 26.99,21.75 29.21,21.75 IC1.10
  Bottom 0.127: R3.1 22.38,19.05 22.38,20.32 v22.54,20.48 22.54,31.43 21.43,32.54 21.43,34.92 21.59,35.08 21.59,44.13 19.84,45.88 PORTA.1
PA1  (via drill 0.3)
  Top 0.127: v17.14,20.48 17.94,19.68 25.4,19.68 26.99,21.27 29.21,21.27 IC1.11
  Bottom 0.127: R4.1 16.99,19.05 16.99,20.32 v17.14,20.48 17.14,26.83 16.51,27.46 16.51,45.24 19.68,48.42 PORTA.2
PA4  (via drill 0.3)
  Top 0.127: v25.72,17.78 26.83,18.89 27.15,18.89 27.46,18.57 31.27,18.57 IC1.14 | v23.18,35.24 22.23,36.2 v19.53,36.2 | v18.26,45.24 18.57,44.93 22.7,44.93 23.65,45.88 24.77,45.88 PORTA.5
  Bottom 0.127: v25.72,17.78 23.18,20.32 v23.18,35.24 | v19.53,36.2 19.05,36.67 19.05,40.48 18.26,41.27 v18.26,45.24
PA5  (via drill 0.3)
  Top 0.127: v26.99,18.26 31.75,18.26 31.75,19.37 IC1.15
  Bottom 0.127: v26.99,18.26 26.51,18.26 24.13,20.64 24.13,38.89 25.88,40.64 25.88,47.47 24.92,48.42 PORTA.6
PA6  (via drill 0.3)
  Top 0.127: v32.07,23.18 32.23,23.18 32.23,19.53 IC1.16
  Bottom 0.127: v32.07,23.18 27.46,27.78 27.46,45.88 PORTA.7
PA7  (via drill 0.3)
  Top 0.127: v32.7,24.13 32.7,19.53 IC1.17 | v30.64,47.47 29.53,47.47 28.57,48.42 27.46,48.42 PORTA.8
  Bottom 0.127: v32.7,24.13 30.96,25.88 30.96,33.18 30.64,33.5 30.64,45.24 30.96,45.56 30.96,47.15 v30.64,47.47
PA8  (via drill 0.3)
  Top 0.127: v39.53,23.65 38.89,23.02 37.78,23.02 IC1.29 | v39.05,35.56 38.42,36.2 36.35,36.2 36.04,35.88 33.18,35.88 32.86,36.2 v29.53,36.2
  Bottom 0.127: v39.53,23.65 39.53,25.24 39.05,25.72 v39.05,35.56 | v29.53,36.2 29.84,36.51 29.84,45.88 PORTA.9
PA15  (via drill 0.3)
  Top 0.127: v32.23,26.83 32.86,26.19 35.72,26.19 35.72,27.78 IC1.38 | v30,31.27 v32.23,31.27
  Bottom 0.127: v32.23,31.27 v32.23,26.83 | v30,31.27 28.57,32.7 28.57,48.58 29.53,49.53 37.47,49.53 37.47,48.58 PORTA.16
PB0  (via drill 0.3)
  Top 0.127: v33.34,24.61 33.34,19.53 IC1.18 | v33.66,34.77 34.13,35.24 36.83,35.24 37.15,34.92 45.4,34.92 PORTB.1
  Bottom 0.127: v33.34,24.61 33.66,24.92 33.66,29.69 33.81,29.84 33.81,34.61 v33.66,34.77
PB1
  Top 0.127: IC1.19 33.81,19.37 33.81,16.03 48.26,16.03 49.37,17.14 49.37,34.92 48.1,34.92 PORTB.2
PB4
  Top 0.127: IC1.40 34.92,27.94 34.92,29.84 45.4,29.84 PORTB.5
PB5  (via drill 0.3)
  Top 0.127: v34.29,26.83 34.29,27.78 IC1.41 | v34.77,31.27 42.55,31.27 42.86,31.59 44.93,31.59 45.56,30.96 46.99,30.96 47.94,30 PORTB.6
  Bottom 0.127: v34.29,26.83 34.77,27.3 v34.77,31.27
PB6  (via drill 0.3)
  Top 0.127: v44.13,30.64 43.81,30.32 33.81,30.32 33.81,27.94 IC1.42
  Bottom 0.127: v44.13,30.64 44.45,30.32 44.45,28.42 45.4,27.46 PORTB.7
PB7  (via drill 0.3)
  Top 0.127: v33.18,30 33.18,27.94 IC1.43 | v36.04,31.91 v33.18,31.91 | v37.47,28.42 46.99,28.42 47.94,27.46 PORTB.8
  Bottom 0.127: v33.18,31.91 v33.18,30 | v36.04,31.91 37.47,30.48 v37.47,28.42
PB8  (via drill 0.3)
  Top 0.127: v43.02,30.96 42.7,30.64 32.38,30.64 32.38,27.94 IC1.45
  Bottom 0.127: v43.02,30.96 44.13,29.84 44.13,26.19 45.4,24.92 PORTB.9
PB9  (via drill 0.3)
  Top 0.127: v31.59,30.64 31.75,30.64 31.75,27.94 IC1.46 | v31.59,31.91 32.23,32.54 41.75,32.54 42.7,33.5 v46.2,33.5
  Bottom 0.127: v31.59,31.91 v31.59,30.64 | v46.2,33.5 46.99,32.7 46.99,25.88 47.94,24.92 PORTB.10
PB10  (via drill 0.3)
  Top 0.127: 34.92,20.64 34.92,19.53 IC1.21 | 34.92,20.64 36.99,20.64 37.47,20.16 v43.34,20.16 | SERIAL2.3 6.03,37.78 20,37.78 21.27,36.51 v22.7,36.51 | v33.97,21.11 34.45,20.64 34.92,20.64
  Bottom 0.127: v43.34,20.16 45.4,22.23 PORTB.11 | v22.7,36.51 23.81,35.4 23.81,20.48 27.3,16.99 30.16,16.99 30.16,17.3 v33.97,21.11
PB12  (via drill 0.3)
  Top 0.127: IC1.25 37.78,20.8 44.45,20.8 45.4,19.84 PORTB.13 45.4,19.68 45.24,19.68 v43.5,17.94
  Bottom 0.127: v43.5,17.94 43.5,15.56 44.29,14.76 44.29,8.41 43.81,7.94 43.81,0.32 33.02,0.32 21.11,12.22 21.11,15.08 22.23,16.19 R5.2
PB13  (via drill 0.3)
  Top 0.127: PORTB.14 47.94,19.84 46.99,20.8 45.09,20.8 44.61,21.27 37.78,21.27 IC1.26 37.62,21.27 v35.08,21.27
  Bottom 0.127: v35.08,21.27 29.53,15.72 29.53,13.34 22.38,13.34 R6.2
PB14  (via drill 0.3)
  Top 0.127: v38.89,21.91 37.78,21.91 IC1.27 | v40.01,19.21 41.91,17.3 45.4,17.3 PORTB.15 | v17.78,14.76 18.89,13.65 43.18,13.65 v44.93,15.4
  Bottom 0.127: v38.89,21.91 40.01,20.8 v40.01,19.21 | v17.78,14.76 17.78,15.4 16.99,16.19 R7.2 | v44.93,15.4 45.4,15.88 45.4,17.14 PORTB.15
PB15  (via drill 0.3)
  Top 0.127: IC1.28 37.78,22.38 38.58,22.38 38.73,22.54 43.81,22.54 45.24,21.11 48.1,21.11 49.05,20.16 49.05,17.3 48.1,17.3 PORTB.16 | v16.99,14.61 18.26,13.34 44.61,13.34 v46.67,15.4
  Bottom 0.127: v16.99,14.61 16.99,13.34 R8.2 | v46.67,15.4 47.94,16.67 47.94,17.14 PORTB.16
RESET  (via drill 0.3)
  Top 0.127: v21.59,17.62 23.18,19.21 30.16,19.21 30.16,23.02 29.84,23.34 29.37,23.34 IC1.7 | R1.1 7.14,9.05 9.05,7.14 10,7.14 12.38,4.76 14.29,4.76 15.24,5.71 SWD_PIN.3
  Bottom 0.127: v21.59,17.62 20.8,16.83 20.8,11.43 15.24,5.87 SWD_PIN.3
RX1  (via drill 0.3)
  Top 0.127: SERIAL1.2 v11.11,34.29 11.27,34.13 v29.21,34.13 | v30.8,25.24 33.5,25.24 34.92,23.81 37.62,23.81 IC1.31 | v29.21,46.99 30.32,46.99 31.27,46.04 32.38,46.04 PORTA.11
  Bottom 0.127: v11.11,34.29 11.11,35.08 13.34,37.31 U2.2 | v30.8,25.24 30.64,25.4 30.64,33.02 29.37,34.29 | 29.37,34.29 28.89,34.77 28.89,46.67 v29.21,46.99 | 29.37,34.29 v29.21,34.13
RX2  (via drill 0.3)
  Top 0.127: v30.64,23.81 30.64,19.53 IC1.13 | v26.83,35.4 26.04,34.61 22.07,34.61 | 22.07,34.61 11.59,34.61 10.95,35.24 2.86,35.24 1.91,34.29 SERIAL3.2 | 22.07,34.61 v22.07,34.77
  Bottom 0.127: v30.64,23.81 26.99,27.46 26.99,35.24 v26.83,35.4 | v22.07,34.77 22.07,44.29 23.34,45.56 23.34,47.47 22.38,48.42 PORTA.4
RX3  (via drill 0.3)
  Top 0.127: v43.97,19.53 43.18,19.53 42.86,19.84 37.31,19.84 36.83,20.32 35.4,20.32 35.4,19.53 IC1.22 | SERIAL2.2 6.67,32.7 v11.11,32.7 | v11.43,14.13 12.54,13.02 v45.24,13.02
  Bottom 0.127: v43.97,19.53 44.45,20 44.45,20.16 45.56,21.27 46.51,21.27 | 46.51,21.27 47.94,21.27 47.94,22.23 PORTB.12 | v11.11,32.7 11.43,32.38 v11.43,14.13 | v45.24,13.02 46.04,13.81 46.04,16.35 46.51,16.83 46.51,21.27
SWCLK  (via drill 0.3)
  Top 0.127: v42.23,27.78 36.35,27.78 IC1.37 | v43.5,11.11 25.08,11.11 18.73,4.76 16.67,4.76 15.24,3.33 SWD_PIN.4
  Bottom 0.127: PORTA.15 37.62,46.04 38.58,46.99 38.58,49.05 42.86,49.05 44.45,47.47 44.45,37.15 42.39,35.08 42.39,27.94 v42.23,27.78 42.23,16.35 43.34,15.24 43.34,11.27 v43.5,11.11
SWDIO  (via drill 0.3)
  Top 0.127: v40.16,27.15 39.53,26.51 | 39.53,26.51 38.42,25.4 37.78,25.4 IC1.34 | v40.96,35.56 42.7,37.31 42.86,37.31 44.45,38.89 44.45,49.53 36.04,49.53 35.08,48.58 PORTA.14 | v44.93,10.48 24.92,10.48 17.78,3.33 SWD_PIN.2 | 39.53,26.51 v42.86,23.18
  Bottom 0.127: v40.16,27.15 40.96,27.94 v40.96,35.56 | v44.93,10.48 44.61,10.79 44.61,14.92 44.13,15.4 44.13,18.57 42.7,20 42.7,23.02 v42.86,23.18
SWO  (via drill 0.3)
  Top 0.127: IC1.39 35.4,27.94 35.4,29.05 44.93,29.05 45.09,28.89 48.42,28.89 49.05,29.53 49.05,32.38 48.1,32.38 PORTB.4 | v49.05,14.61 46.2,11.75 18.57,11.75 12.7,5.87 SWD_PIN.5
  Bottom 0.127: v49.05,14.61 49.05,31.43 48.1,32.38 PORTB.4
TX1  (via drill 0.3)
  Top 0.127: v13.49,36.2 12.86,36.83 SERIAL1.3 | v40.16,25.08 38.58,23.5 37.78,23.5 IC1.30 | v39.69,33.18 39.53,33.02 v31.91,33.02 | v16.19,46.35 19.37,49.53 28.89,49.53 29.84,48.58 PORTA.10
  Bottom 0.127: v13.49,36.2 14.61,37.31 U2.3 14.61,37.47 16.19,39.05 v16.19,46.35 | v40.16,25.08 39.53,25.72 39.53,33.02 v39.69,33.18 | v31.91,33.02 31.91,45.09 31.27,45.72 31.27,47.62 30.48,48.42 30,48.42 PORTA.10
TX2  (via drill 0.3)
  Top 0.127: v28.26,20.48 28.89,20.48 29.21,20.8 IC1.12 | v26.19,40.01 21.27,40.01 19.68,38.42 3.49,38.42 1.91,36.83 SERIAL3.3
  Bottom 0.127: v28.26,20.48 26.67,22.07 26.67,34.77 26.19,35.24 v26.19,40.01 26.19,48.58 25.24,49.53 21.27,49.53 21.27,46.99 22.23,46.04 PORTA.3
UNIC  (via drill 0.3)
  Top 0.127: v42.23,9.68 42.23,8.57 C7.2 42.23,8.41 v45.24,8.41
  Bottom 0.127: 47.47,8.41 47.47,11.27 RCAN2.2 | RCAN3.1 42.23,8.41 v42.23,9.68 42.23,11.27 RCAN1.1 | v45.24,8.41 47.47,8.41 | 47.47,8.41 RCAN4.2
VBUS  (via drill 0.3)
  Top 0.127: CN1.VBUS 40.96,41.43 40.96,40.48 38.73,38.26 36.35,38.26 35.08,36.99 C2.1 34.92,36.99 34.45,36.99 v33.66,37.78 | v33.34,39.05 31.43,39.05 31.11,39.37 IC2.3 30.96,39.37 21.43,39.37 v20.32,38.26 | v19.21,32.86 16.83,30.48 9.53,30.48 9.53,26.99 8.89,26.35 8.89,25.24 CN2.VBUS
  Bottom 0.127: v33.34,39.05 33.66,38.73 v33.66,37.78 | v19.21,32.86 20.32,33.97 v20.32,38.26
VCC  (via drill 0.3)
  Top 0.127: BOOT1.1 1.75,47.94 1.75,44.77 BOOT0.1 1.75,44.61 1.75,39.37 SERIAL3.4 SERIAL2.4 SERIAL1.4 18.73,39.37 20,40.64 32.54,40.64 34.29,38.89 | 34.29,38.89 33.81,38.42 32.38,38.42 31.11,37.15 IC2.2 | 34.29,38.89 34.77,39.37 RUSB.1 34.29,38.89 | 36.67,19.05 37.31,18.41 37.31,17.3 v34.77,17.3 | 36.67,19.05 36.35,19.37 IC1.24 | v36.67,26.51 37.62,26.51 IC1.36 | 36.67,19.05 v36.99,19.37 | 15.72,25.4 15.72,23.65 | 15.72,23.65 15.72,21.91 LED4.A 15.72,21.75 16.51,20.95 16.51,18.26 14.13,18.26 12.38,16.51 11.11,16.51 10,15.4 10,12.86 3.49,12.86 2.54,11.91 LEDPWR.A 2.54,9.21 | 15.72,25.4 15.72,27.15 | 15.72,27.15 15.72,28.57 LED0.A | 15.72,25.4 LED2.A | 30.64,26.67 29.84,25.88 29.37,25.88 IC1.2 | 30.64,26.67 30.64,27.78 IC1.48 30.64,27.94 21.11,27.94 | 21.11,27.94 21.11,28.57 LED1.A 21.11,27.94 | 21.11,27.94 21.11,25.4 | 21.11,25.4 21.11,23.65 | 21.11,23.65 21.11,21.91 LED5.A | 21.11,25.4 LED3.A | 21.11,23.65 15.72,23.65 | 2.54,9.21 4.13,9.21 R1.2 | S2.4 8.57,1.59 2.22,1.59 S2.3 2.06,1.59 0.32,1.59 0.32,6.99 2.54,9.21 | v36.04,25.24 35.72,25.56 31.75,25.56 30.64,26.67 | 15.72,27.15 v10.16,27.15
  Bottom 0.127: C6.2 37.47,11.43 37.47,6.67 38.42,5.71 U1.3 38.58,5.71 39.53,4.76 39.53,4.13 39.21,3.81 36.2,3.81 36.2,11.43 33.5,14.13 C1.1 33.5,14.29 33.5,16.03 v34.77,17.3 | v36.67,26.51 36.99,26.19 36.99,25.24 | v36.99,19.37 36.99,25.24 | SWD_PIN.1 17.78,5.71 16.19,4.13 16.19,2.86 14.92,1.59 8.73,1.59 S2.4 | v36.04,25.24 36.99,25.24 | v10.16,27.15 10.16,37.62 8.41,39.37 SERIAL1.4
XI7  (via drill 0.3)
  Top 0.127: v23.18,41.75 22.86,41.43 19.53,41.43 Q2.1
  Bottom 0.127: U2.7 19.68,37.47 19.53,37.62 19.53,41.27 Q2.1 | v23.18,41.75 23.18,40.96 23.5,40.64 C5.1
XI8  (via drill 0.3)
  Top 0.127: v10.95,41.75 11.27,41.43 14.61,41.43 Q2.2
  Bottom 0.127: U2.8 20.95,43.34 18.73,45.56 18.73,46.35 19.84,47.47 20.8,47.47 20.8,48.9 20.16,49.53 14.61,49.53 Q2.2 | v10.95,41.75 10.95,41.27 11.59,40.64 C8.1

### Text on the board
tNames: PA1 | PA15 | PA0 | PA2 | PA4 | PA6 | PA8 | PA10 | PA12 | VCC | TX1 | PB1 | PB0 | RX1 | PB2 | GND | PB4 | PB6 | PB8 | PB10 | PB12 | PB14 | PB15 | STM32F103C8T6 | SWO | RESET | VCC | GND | SWCLK | SWDIO